# Altium project SmartHaloEE.PrjPcb (part 2 of 2)

## Sheet 7_LEDS.SchDoc: SmartHalo - Leds
size B; Author: Sébastien Gélinas; Organization: SmartHalo; Address1: 5445 de Gaspé; Address2: Montréal, QC; Address3: Canada; Address4: H2T 3B2; Revision: 1; SheetNumber: 7; SheetTotal: 7
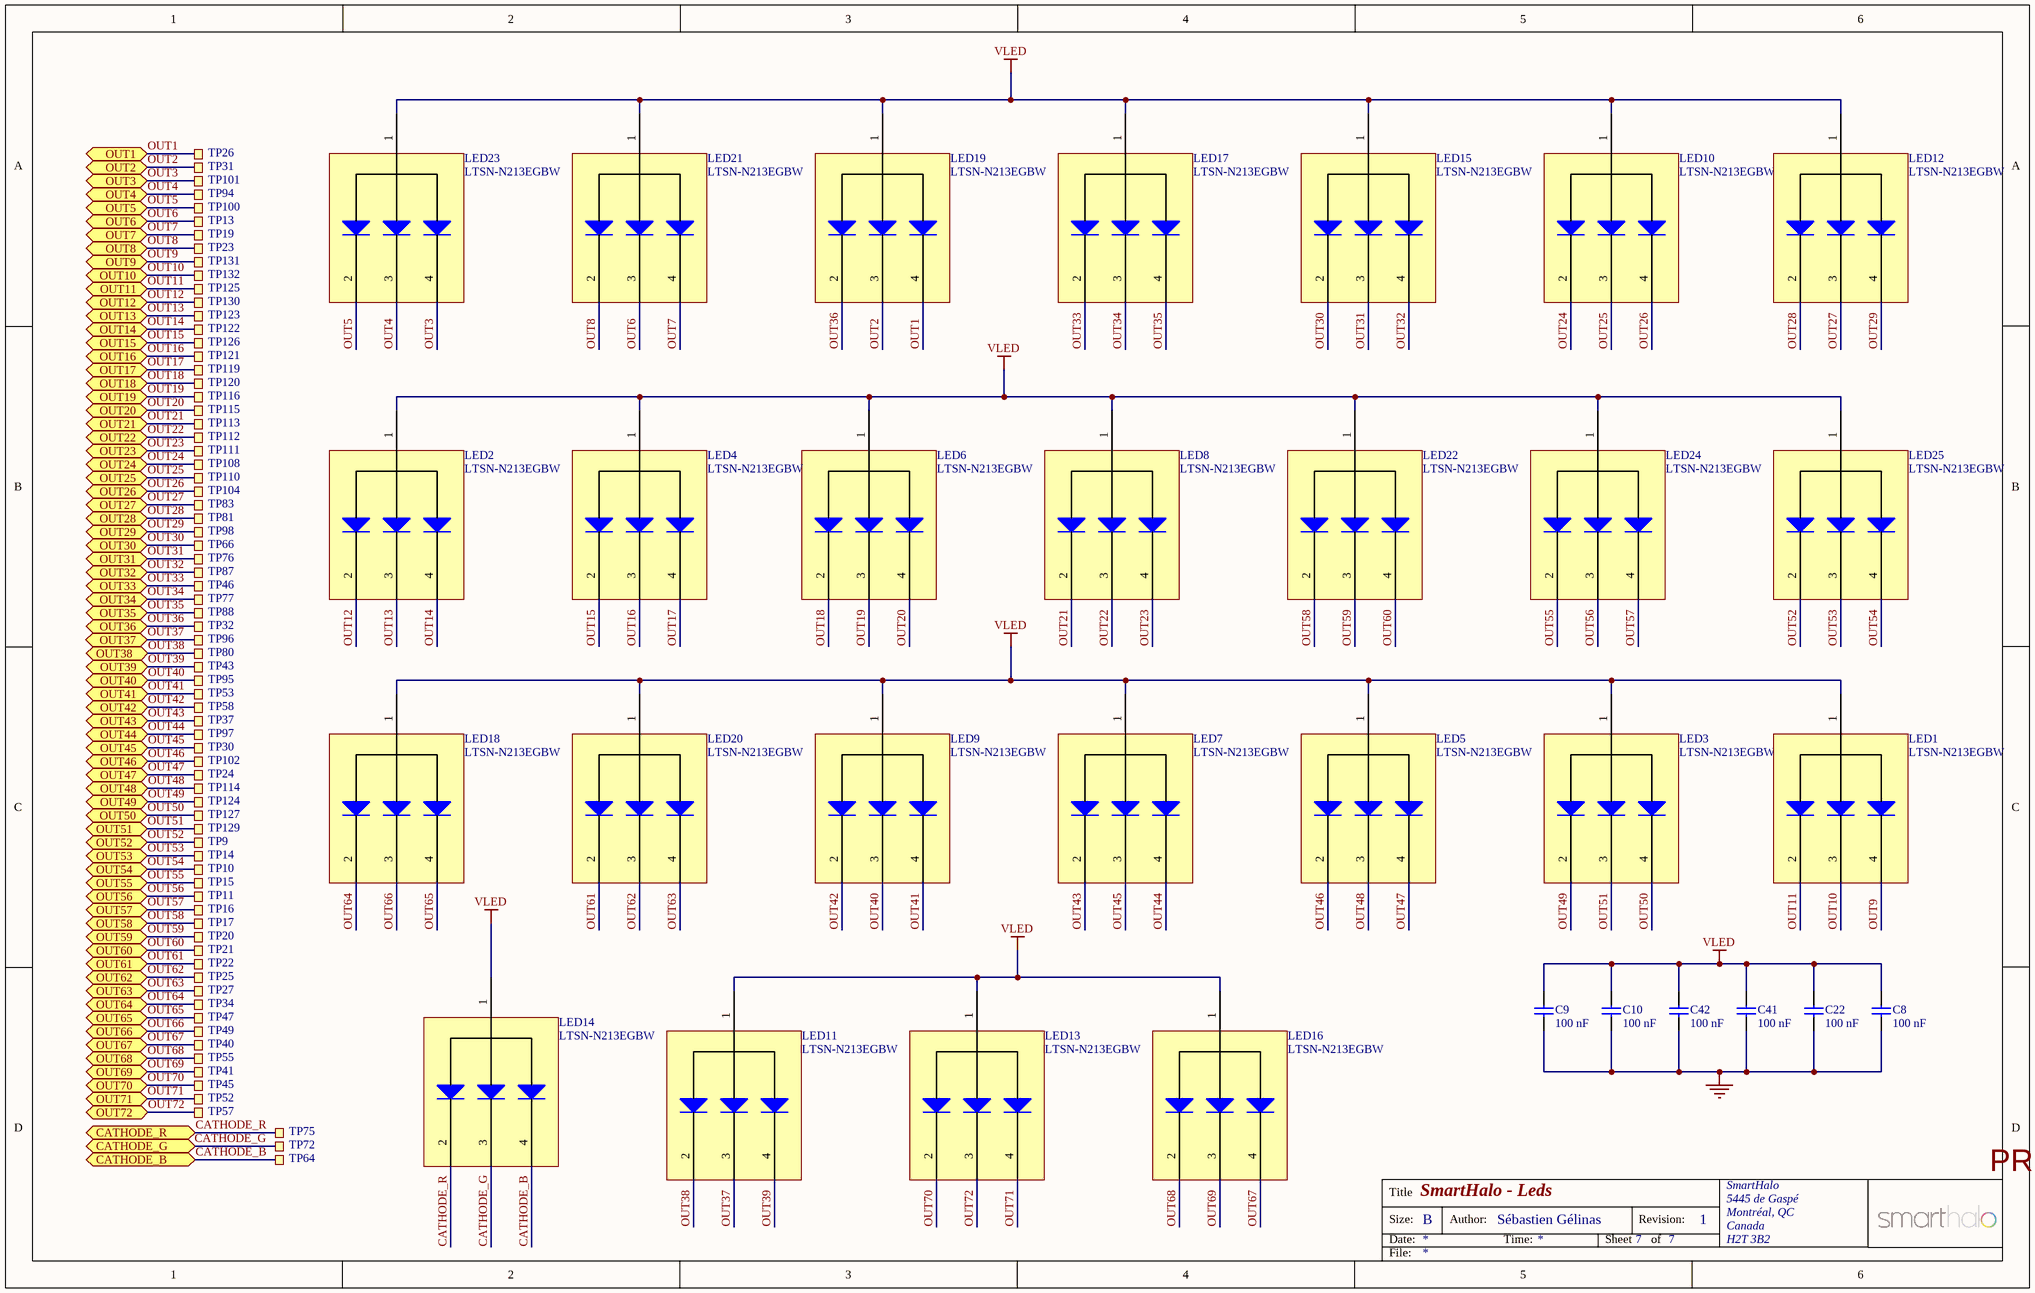
[diagram p7: 7_LEDS.SchDoc]

### Parts
C8  100 nF  [Varitron_CAP0402]
C9  100 nF  [Varitron_CAP0402]
C10  100 nF  [Varitron_CAP0402]
C22  100 nF  [Varitron_CAP0402]
C41  100 nF  [Varitron_CAP0402]
C42  100 nF  [Varitron_CAP0402]
LED1  LTSN-N213EGBW  [LTSN-N213EGBW]
LED2  LTSN-N213EGBW  [LTSN-N213EGBW]
LED3  LTSN-N213EGBW  [LTSN-N213EGBW]
LED4  LTSN-N213EGBW  [LTSN-N213EGBW]
LED5  LTSN-N213EGBW  [LTSN-N213EGBW]
LED6  LTSN-N213EGBW  [LTSN-N213EGBW]
LED7  LTSN-N213EGBW  [LTSN-N213EGBW]
LED8  LTSN-N213EGBW  [LTSN-N213EGBW]
LED9  LTSN-N213EGBW  [LTSN-N213EGBW]
LED10  LTSN-N213EGBW  [LTSN-N213EGBW]
LED11  LTSN-N213EGBW  [LTSN-N213EGBW]
LED12  LTSN-N213EGBW  [LTSN-N213EGBW]
LED13  LTSN-N213EGBW  [LTSN-N213EGBW]
LED14  LTSN-N213EGBW  [LTSN-N213EGBW]
LED15  LTSN-N213EGBW  [LTSN-N213EGBW]
LED16  LTSN-N213EGBW  [LTSN-N213EGBW]
LED17  LTSN-N213EGBW  [LTSN-N213EGBW]
LED18  LTSN-N213EGBW  [LTSN-N213EGBW]
LED19  LTSN-N213EGBW  [LTSN-N213EGBW]
LED20  LTSN-N213EGBW  [LTSN-N213EGBW]
LED21  LTSN-N213EGBW  [LTSN-N213EGBW]
LED22  LTSN-N213EGBW  [LTSN-N213EGBW]
LED23  LTSN-N213EGBW  [LTSN-N213EGBW]
LED24  LTSN-N213EGBW  [LTSN-N213EGBW]
LED25  LTSN-N213EGBW  [LTSN-N213EGBW]
TP9  (no value)  [TESTPAD-TH-35mils]  (no BOM)
TP10  (no value)  [TESTPAD-TH-35mils]  (no BOM)
TP11  (no value)  [TESTPAD-TH-35mils]  (no BOM)
TP13  (no value)  [TESTPAD-TH-35mils]  (no BOM)
TP14  (no value)  [TESTPAD-TH-35mils]  (no BOM)
TP15  (no value)  [TESTPAD-TH-35mils]  (no BOM)
TP16  (no value)  [TESTPAD-TH-35mils]  (no BOM)
TP17  (no value)  [TESTPAD-TH-35mils]  (no BOM)
TP19  (no value)  [TESTPAD-TH-35mils]  (no BOM)
TP20  (no value)  [TESTPAD-TH-35mils]  (no BOM)
TP21  (no value)  [TESTPAD-TH-35mils]  (no BOM)
TP22  (no value)  [TESTPAD-TH-35mils]  (no BOM)
TP23  (no value)  [TESTPAD-TH-35mils]  (no BOM)
TP24  (no value)  [TESTPAD-TH-35mils]  (no BOM)
TP25  (no value)  [TESTPAD-TH-35mils]  (no BOM)
TP26  (no value)  [TESTPAD-TH-35mils]  (no BOM)
TP27  (no value)  [TESTPAD-TH-35mils]  (no BOM)
TP30  (no value)  [TESTPAD-TH-35mils]  (no BOM)
TP31  (no value)  [TESTPAD-TH-35mils]  (no BOM)
TP32  (no value)  [TESTPAD-TH-35mils]  (no BOM)
TP34  (no value)  [TESTPAD-TH-35mils]  (no BOM)
TP37  (no value)  [TESTPAD-TH-35mils]  (no BOM)
TP40  (no value)  [TESTPAD-TH-35mils]  (no BOM)
TP41  (no value)  [TESTPAD-TH-35mils]  (no BOM)
TP43  (no value)  [TESTPAD-TH-35mils]  (no BOM)
TP45  (no value)  [TESTPAD-TH-35mils]  (no BOM)
TP46  (no value)  [TESTPAD-TH-35mils]  (no BOM)
TP47  (no value)  [TESTPAD-TH-35mils]  (no BOM)
TP49  (no value)  [TESTPAD-TH-35mils]  (no BOM)
TP52  (no value)  [TESTPAD-TH-35mils]  (no BOM)
TP53  (no value)  [TESTPAD-TH-35mils]  (no BOM)
TP55  (no value)  [TESTPAD-TH-35mils]  (no BOM)
TP57  (no value)  [TESTPAD-TH-35mils]  (no BOM)
TP58  (no value)  [TESTPAD-TH-35mils]  (no BOM)
TP64  (no value)  [TESTPAD-TH-35mils]  (no BOM)
TP66  (no value)  [TESTPAD-TH-35mils]  (no BOM)
TP72  (no value)  [TESTPAD-TH-35mils]  (no BOM)
TP75  (no value)  [TESTPAD-TH-35mils]  (no BOM)
TP76  (no value)  [TESTPAD-TH-35mils]  (no BOM)
TP77  (no value)  [TESTPAD-TH-35mils]  (no BOM)
TP80  (no value)  [TESTPAD-TH-35mils]  (no BOM)
TP81  (no value)  [TESTPAD-TH-35mils]  (no BOM)
TP83  (no value)  [TESTPAD-TH-35mils]  (no BOM)
TP87  (no value)  [TESTPAD-TH-35mils]  (no BOM)
TP88  (no value)  [TESTPAD-TH-35mils]  (no BOM)
TP94  (no value)  [TESTPAD-TH-35mils]  (no BOM)
TP95  (no value)  [TESTPAD-TH-35mils]  (no BOM)
TP96  (no value)  [TESTPAD-TH-35mils]  (no BOM)
TP97  (no value)  [TESTPAD-TH-35mils]  (no BOM)
TP98  (no value)  [TESTPAD-TH-35mils]  (no BOM)
TP100  (no value)  [TESTPAD-TH-35mils]  (no BOM)
TP101  (no value)  [TESTPAD-TH-35mils]  (no BOM)
TP102  (no value)  [TESTPAD-TH-35mils]  (no BOM)
TP104  (no value)  [TESTPAD-TH-35mils]  (no BOM)
TP108  (no value)  [TESTPAD-TH-35mils]  (no BOM)
TP110  (no value)  [TESTPAD-TH-35mils]  (no BOM)
TP111  (no value)  [TESTPAD-TH-35mils]  (no BOM)
TP112  (no value)  [TESTPAD-TH-35mils]  (no BOM)
TP113  (no value)  [TESTPAD-TH-35mils]  (no BOM)
TP114  (no value)  [TESTPAD-TH-35mils]  (no BOM)
TP115  (no value)  [TESTPAD-TH-35mils]  (no BOM)
TP116  (no value)  [TESTPAD-TH-35mils]  (no BOM)
TP119  (no value)  [TESTPAD-TH-35mils]  (no BOM)
TP120  (no value)  [TESTPAD-TH-35mils]  (no BOM)
TP121  (no value)  [TESTPAD-TH-35mils]  (no BOM)
TP122  (no value)  [TESTPAD-TH-35mils]  (no BOM)
TP123  (no value)  [TESTPAD-TH-35mils]  (no BOM)
TP124  (no value)  [TESTPAD-TH-35mils]  (no BOM)
TP125  (no value)  [TESTPAD-TH-35mils]  (no BOM)
TP126  (no value)  [TESTPAD-TH-35mils]  (no BOM)
TP127  (no value)  [TESTPAD-TH-35mils]  (no BOM)
TP129  (no value)  [TESTPAD-TH-35mils]  (no BOM)
TP130  (no value)  [TESTPAD-TH-35mils]  (no BOM)
TP131  (no value)  [TESTPAD-TH-35mils]  (no BOM)
TP132  (no value)  [TESTPAD-TH-35mils]  (no BOM)

### Ports
CATHODE_B, CATHODE_G, CATHODE_R, OUT1, OUT2, OUT3, OUT4, OUT5, OUT6, OUT7, OUT8, OUT9, OUT10, OUT11, OUT12, OUT13, OUT14, OUT15, OUT16, OUT17, OUT18, OUT19, OUT20, OUT21, OUT22, OUT23, OUT24, OUT25, OUT26, OUT27, OUT28, OUT29, OUT30, OUT31, OUT32, OUT33, OUT34, OUT35, OUT36, OUT37, OUT38, OUT39, OUT40, OUT41, OUT42, OUT43, OUT44, OUT45, OUT46, OUT47, OUT48, OUT49, OUT50, OUT51, OUT52, OUT53, OUT54, OUT55, OUT56, OUT57, OUT58, OUT59, OUT60, OUT61, OUT62, OUT63, OUT64, OUT65, OUT66, OUT67, OUT68, OUT69, OUT70, OUT71, OUT72

### Nets
GND: C8.2 C9.2 C10.2 C22.2 C41.2 C42.2
VLED: C8.1 C9.1 C10.1 C22.1 C41.1 C42.1 LED1.1(Anode) LED2.1(Anode) LED3.1(Anode) LED4.1(Anode) LED5.1(Anode) LED6.1(Anode) LED7.1(Anode) LED8.1(Anode) LED9.1(Anode) LED10.1(Anode) LED11.1(Anode) LED12.1(Anode) LED13.1(Anode) LED14.1(Anode) LED15.1(Anode) LED16.1(Anode) LED17.1(Anode) LED18.1(Anode) LED19.1(Anode) LED20.1(Anode) LED21.1(Anode) LED22.1(Anode) LED23.1(Anode) LED24.1(Anode) LED25.1(Anode)
CATHODE_B: LED14.4(Cathode_Blue) TP64.1 ; port CATHODE_B
CATHODE_G: TP72.1 ; port CATHODE_G
CATHODE_G: LED14.3(Cathode_Green)  [a separate net that carries the same name]
CATHODE_R: LED14.2(Cathode_Red) TP75.1 ; port CATHODE_R
OUT1: LED19.4(Cathode_Blue) TP26.1 ; port OUT1
OUT2: LED19.3(Cathode_Green) TP31.1 ; port OUT2
OUT3: LED23.4(Cathode_Blue) TP101.1 ; port OUT3
OUT4: LED23.3(Cathode_Green) TP94.1 ; port OUT4
OUT5: LED23.2(Cathode_Red) TP100.1 ; port OUT5
OUT6: LED21.3(Cathode_Green) TP13.1 ; port OUT6
OUT7: LED21.4(Cathode_Blue) TP19.1 ; port OUT7
OUT8: LED21.2(Cathode_Red) TP23.1 ; port OUT8
OUT9: LED1.4(Cathode_Blue) TP131.1 ; port OUT9
OUT10: LED1.3(Cathode_Green) TP132.1 ; port OUT10
OUT11: LED1.2(Cathode_Red) TP125.1 ; port OUT11
OUT12: LED2.2(Cathode_Red) TP130.1 ; port OUT12
OUT13: LED2.3(Cathode_Green) TP123.1 ; port OUT13
OUT14: LED2.4(Cathode_Blue) TP122.1 ; port OUT14
OUT15: LED4.2(Cathode_Red) TP126.1 ; port OUT15
OUT16: LED4.3(Cathode_Green) TP121.1 ; port OUT16
OUT17: LED4.4(Cathode_Blue) TP119.1 ; port OUT17
OUT18: LED6.2(Cathode_Red) TP120.1 ; port OUT18
OUT19: LED6.3(Cathode_Green) TP116.1 ; port OUT19
OUT20: LED6.4(Cathode_Blue) TP115.1 ; port OUT20
OUT21: LED8.2(Cathode_Red) TP113.1 ; port OUT21
OUT22: LED8.3(Cathode_Green) TP112.1 ; port OUT22
OUT23: LED8.4(Cathode_Blue) TP111.1 ; port OUT23
OUT24: LED10.2(Cathode_Red) TP108.1 ; port OUT24
OUT25: LED10.3(Cathode_Green) TP110.1 ; port OUT25
OUT26: LED10.4(Cathode_Blue) TP104.1 ; port OUT26
OUT27: LED12.3(Cathode_Green) TP83.1 ; port OUT27
OUT28: LED12.2(Cathode_Red) TP81.1 ; port OUT28
OUT29: LED12.4(Cathode_Blue) TP98.1 ; port OUT29
OUT30: LED15.2(Cathode_Red) TP66.1 ; port OUT30
OUT31: LED15.3(Cathode_Green) TP76.1 ; port OUT31
OUT32: LED15.4(Cathode_Blue) TP87.1 ; port OUT32
OUT33: LED17.2(Cathode_Red) TP46.1 ; port OUT33
OUT34: LED17.3(Cathode_Green) TP77.1 ; port OUT34
OUT35: LED17.4(Cathode_Blue) TP88.1 ; port OUT35
OUT36: LED19.2(Cathode_Red) TP32.1 ; port OUT36
OUT37: LED11.3(Cathode_Green) TP96.1 ; port OUT37
OUT38: LED11.2(Cathode_Red) TP80.1 ; port OUT38
OUT39: LED11.4(Cathode_Blue) TP43.1 ; port OUT39
OUT40: LED9.3(Cathode_Green) TP95.1 ; port OUT40
OUT41: LED9.4(Cathode_Blue) TP53.1 ; port OUT41
OUT42: LED9.2(Cathode_Red) TP58.1 ; port OUT42
OUT43: LED7.2(Cathode_Red) TP37.1 ; port OUT43
OUT44: LED7.4(Cathode_Blue) TP97.1 ; port OUT44
OUT45: LED7.3(Cathode_Green) TP30.1 ; port OUT45
OUT46: LED5.2(Cathode_Red) TP102.1 ; port OUT46
OUT47: LED5.4(Cathode_Blue) TP24.1 ; port OUT47
OUT48: LED5.3(Cathode_Green) TP114.1 ; port OUT48
OUT49: LED3.2(Cathode_Red) TP124.1 ; port OUT49
OUT50: LED3.4(Cathode_Blue) TP127.1 ; port OUT50
OUT51: LED3.3(Cathode_Green) TP129.1 ; port OUT51
OUT52: LED25.2(Cathode_Red) TP9.1 ; port OUT52
OUT53: LED25.3(Cathode_Green) TP14.1 ; port OUT53
OUT54: LED25.4(Cathode_Blue) TP10.1 ; port OUT54
OUT55: LED24.2(Cathode_Red) TP15.1 ; port OUT55
OUT56: LED24.3(Cathode_Green) TP11.1 ; port OUT56
OUT57: LED24.4(Cathode_Blue) TP16.1 ; port OUT57
OUT58: LED22.2(Cathode_Red) TP17.1 ; port OUT58
OUT59: LED22.3(Cathode_Green) TP20.1 ; port OUT59
OUT60: LED22.4(Cathode_Blue) TP21.1 ; port OUT60
OUT61: LED20.2(Cathode_Red) TP22.1 ; port OUT61
OUT62: LED20.3(Cathode_Green) TP25.1 ; port OUT62
OUT63: LED20.4(Cathode_Blue) TP27.1 ; port OUT63
OUT64: LED18.2(Cathode_Red) TP34.1 ; port OUT64
OUT65: LED18.4(Cathode_Blue) TP47.1 ; port OUT65
OUT66: LED18.3(Cathode_Green) TP49.1 ; port OUT66
OUT67: LED16.4(Cathode_Blue) TP40.1 ; port OUT67
OUT68: LED16.2(Cathode_Red) TP55.1 ; port OUT68
OUT69: LED16.3(Cathode_Green) TP41.1 ; port OUT69
OUT70: LED13.2(Cathode_Red) TP45.1 ; port OUT70
OUT71: LED13.4(Cathode_Blue) TP52.1 ; port OUT71
OUT72: LED13.3(Cathode_Green) TP57.1 ; port OUT72

### Notes on the sheet
- PRELIMINARY: DO NOT USE FOR PRODUCTION
- Labels drawn without touching a wire or pin: CATHODE_G
- Title
- Size:
- Date:
- B
- Author:
- Time:
- Sheet
- Revision:
- of
- File:

### Library data of the parts
C8-C10 C22 C41 C42 = Varitron_CAP0402: 100 nF 10V X7R 10% 0402 (1005 Metric)  SMD; Case-EIA: 0402; Case-Metric: 1005; Tolerance: 10%; Technology: SMT; Temperature Coefficient: X7R; Voltage Rating: 10V; Value: 100 nF
LED1-LED25 = LTSN-N213EGBW: LED SMD LTSN-N213EGBW; Manufacturer: LiteOn; Manufacturer Part Number: LTSN-N213EGBW; Part Number: LTSN-N213EGBW
TP9-TP11 TP13-TP17 TP19-TP27 TP30-TP32 TP34 TP37 TP40 TP41 TP43 TP45-TP47 TP49 TP52 TP53 TP55 TP57 TP58 TP64 TP66 TP72 TP75-TP77 TP80 TP81 TP83 TP87 TP88 TP94-TP98 TP100-TP102 TP104 TP108 TP110-TP116 TP119-TP127 TP129-TP132 = TESTPAD_TH_35mils: Testpoint, through hole, 35 mils; Value: TP

## Nets that join several sheets
GND: 1_PWR (32 pins), 2_BLE (30 pins), 3_LEDDRIVERS (20 pins), 4_SENSORS (11 pins), 5_MISC (19 pins), 6_ALARM (13 pins), 7_LEDS (6 pins)
S2V8: 1_PWR (C47.1 TP128.1 U12.5), 4_SENSORS (C2.1 C3.1 U1.5), 6_ALARM (6 pins)
VBZ: 1_PWR (C30.1 D3.1 R15.2 TP54.1), 6_ALARM (Q3.2 Q4.2 R22.2 R25.2)
VDD_nRF: 1_PWR (C49.1 TP18.1 U13.5), 2_BLE (14 pins), 4_SENSORS (8 pins), 5_MISC (C59.1 C60.1 U16.1)
VLED: 1_PWR (C53.1 U15.2 U15.10), 3_LEDDRIVERS (9 pins), 7_LEDS (31 pins)
VUSB: 1_PWR (C23.1 TP90.1 U5.1), 5_MISC (6 pins)
ALARMB: 1_PWR (TP8.1 U14.4), 2_BLE (R30.1 U3.14)
BZR: 2_BLE (U3.4), 6_ALARM (5 pins)
~{CHG}: 1_PWR (U5.8), 2_BLE (R13.2 U3.18)
CATHODE_B: 3_LEDDRIVERS (R14.2), 7_LEDS (LED14.4 TP64.1)
CATHODE_G: 3_LEDDRIVERS (R11.2), 7_LEDS (TP72.1)
CATHODE_R: 3_LEDDRIVERS (R7.2), 7_LEDS (LED14.2 TP75.1)
CENTRAL_B: 2_BLE (U3.41), 3_LEDDRIVERS (Q2.2 TP68.1)
CENTRAL_G: 2_BLE (U3.42), 3_LEDDRIVERS (Q2.5 TP67.1)
CENTRAL_R: 2_BLE (U3.40), 3_LEDDRIVERS (Q1.5 TP78.1)
CTS: 2_BLE (U3.28), 5_MISC (TP103.1 U16.8)
EN_2_8V: 1_PWR (TP12.1 U12.3), 2_BLE (R29.2 U3.16)
EN_POW_MCU: 1_PWR (U13.3), 2_BLE (Q1.6 R4.1 TP6.1)
EN_VLED: 1_PWR (TP69.1 U15.6), 2_BLE (R31.2 U3.15)
FRONTLED: 2_BLE (U3.43), 3_LEDDRIVERS (TP105.1 U4.1 U6.1)
INT_1_XL: 2_BLE (U3.5), 4_SENSORS (TP5.1 U11.12)
INT_2_XL: 2_BLE (U3.6), 4_SENSORS (TP4.1 U11.11)
INT_MAG: 2_BLE (U3.7), 4_SENSORS (TP2.1 U11.7)
ISET2: 1_PWR (TP74.1 U5.7), 2_BLE (U3.19)
OUT1: 3_LEDDRIVERS (U2.43), 7_LEDS (LED19.4 TP26.1)
OUT2: 3_LEDDRIVERS (U2.44), 7_LEDS (LED19.3 TP31.1)
OUT3: 3_LEDDRIVERS (U2.1), 7_LEDS (LED23.4 TP101.1)
OUT4: 3_LEDDRIVERS (U2.2), 7_LEDS (LED23.3 TP94.1)
OUT5: 3_LEDDRIVERS (U2.3), 7_LEDS (LED23.2 TP100.1)
OUT6: 3_LEDDRIVERS (U2.4), 7_LEDS (LED21.3 TP13.1)
OUT7: 3_LEDDRIVERS (U2.5), 7_LEDS (LED21.4 TP19.1)
OUT8: 3_LEDDRIVERS (U2.6), 7_LEDS (LED21.2 TP23.1)
OUT9: 3_LEDDRIVERS (U2.7), 7_LEDS (LED1.4 TP131.1)
OUT10: 3_LEDDRIVERS (U2.8), 7_LEDS (LED1.3 TP132.1)
OUT11: 3_LEDDRIVERS (U2.9), 7_LEDS (LED1.2 TP125.1)
OUT12: 3_LEDDRIVERS (U2.10), 7_LEDS (LED2.2 TP130.1)
OUT13: 3_LEDDRIVERS (U2.11), 7_LEDS (LED2.3 TP123.1)
OUT14: 3_LEDDRIVERS (U2.12), 7_LEDS (LED2.4 TP122.1)
OUT15: 3_LEDDRIVERS (U2.13), 7_LEDS (LED4.2 TP126.1)
OUT16: 3_LEDDRIVERS (U2.14), 7_LEDS (LED4.3 TP121.1)
OUT17: 3_LEDDRIVERS (U2.15), 7_LEDS (LED4.4 TP119.1)
OUT18: 3_LEDDRIVERS (U2.16), 7_LEDS (LED6.2 TP120.1)
OUT19: 3_LEDDRIVERS (U2.18), 7_LEDS (LED6.3 TP116.1)
OUT20: 3_LEDDRIVERS (U2.19), 7_LEDS (LED6.4 TP115.1)
OUT21: 3_LEDDRIVERS (U2.20), 7_LEDS (LED8.2 TP113.1)
OUT22: 3_LEDDRIVERS (U2.21), 7_LEDS (LED8.3 TP112.1)
OUT23: 3_LEDDRIVERS (U2.22), 7_LEDS (LED8.4 TP111.1)
OUT24: 3_LEDDRIVERS (U2.23), 7_LEDS (LED10.2 TP108.1)
OUT25: 3_LEDDRIVERS (U2.24), 7_LEDS (LED10.3 TP110.1)
OUT26: 3_LEDDRIVERS (U2.25), 7_LEDS (LED10.4 TP104.1)
OUT27: 3_LEDDRIVERS (U2.26), 7_LEDS (LED12.3 TP83.1)
OUT28: 3_LEDDRIVERS (U2.27), 7_LEDS (LED12.2 TP81.1)
OUT29: 3_LEDDRIVERS (U2.28), 7_LEDS (LED12.4 TP98.1)
OUT30: 3_LEDDRIVERS (U2.29), 7_LEDS (LED15.2 TP66.1)
OUT31: 3_LEDDRIVERS (U2.30), 7_LEDS (LED15.3 TP76.1)
OUT32: 3_LEDDRIVERS (U2.31), 7_LEDS (LED15.4 TP87.1)
OUT33: 3_LEDDRIVERS (U2.32), 7_LEDS (LED17.2 TP46.1)
OUT34: 3_LEDDRIVERS (U2.33), 7_LEDS (LED17.3 TP77.1)
OUT35: 3_LEDDRIVERS (U2.34), 7_LEDS (LED17.4 TP88.1)
OUT36: 3_LEDDRIVERS (U2.35), 7_LEDS (LED19.2 TP32.1)
OUT37: 3_LEDDRIVERS (U10.43), 7_LEDS (LED11.3 TP96.1)
OUT38: 3_LEDDRIVERS (U10.44), 7_LEDS (LED11.2 TP80.1)
OUT39: 3_LEDDRIVERS (U10.1), 7_LEDS (LED11.4 TP43.1)
OUT40: 3_LEDDRIVERS (U10.2), 7_LEDS (LED9.3 TP95.1)
OUT41: 3_LEDDRIVERS (U10.3), 7_LEDS (LED9.4 TP53.1)
OUT42: 3_LEDDRIVERS (U10.4), 7_LEDS (LED9.2 TP58.1)
OUT43: 3_LEDDRIVERS (U10.5), 7_LEDS (LED7.2 TP37.1)
OUT44: 3_LEDDRIVERS (U10.6), 7_LEDS (LED7.4 TP97.1)
OUT45: 3_LEDDRIVERS (U10.7), 7_LEDS (LED7.3 TP30.1)
OUT46: 3_LEDDRIVERS (U10.8), 7_LEDS (LED5.2 TP102.1)
OUT47: 3_LEDDRIVERS (U10.9), 7_LEDS (LED5.4 TP24.1)
OUT48: 3_LEDDRIVERS (U10.10), 7_LEDS (LED5.3 TP114.1)
OUT49: 3_LEDDRIVERS (U10.11), 7_LEDS (LED3.2 TP124.1)
OUT50: 3_LEDDRIVERS (U10.12), 7_LEDS (LED3.4 TP127.1)
OUT51: 3_LEDDRIVERS (U10.13), 7_LEDS (LED3.3 TP129.1)
OUT52: 3_LEDDRIVERS (U10.14), 7_LEDS (LED25.2 TP9.1)
OUT53: 3_LEDDRIVERS (U10.15), 7_LEDS (LED25.3 TP14.1)
OUT54: 3_LEDDRIVERS (U10.16), 7_LEDS (LED25.4 TP10.1)
OUT55: 3_LEDDRIVERS (U10.18), 7_LEDS (LED24.2 TP15.1)
OUT56: 3_LEDDRIVERS (U10.19), 7_LEDS (LED24.3 TP11.1)
OUT57: 3_LEDDRIVERS (U10.20), 7_LEDS (LED24.4 TP16.1)
OUT58: 3_LEDDRIVERS (U10.21), 7_LEDS (LED22.2 TP17.1)
OUT59: 3_LEDDRIVERS (U10.22), 7_LEDS (LED22.3 TP20.1)
OUT60: 3_LEDDRIVERS (U10.23), 7_LEDS (LED22.4 TP21.1)
OUT61: 3_LEDDRIVERS (U10.24), 7_LEDS (LED20.2 TP22.1)
OUT62: 3_LEDDRIVERS (U10.25), 7_LEDS (LED20.3 TP25.1)
OUT63: 3_LEDDRIVERS (U10.26), 7_LEDS (LED20.4 TP27.1)
OUT64: 3_LEDDRIVERS (U10.27), 7_LEDS (LED18.2 TP34.1)
OUT65: 3_LEDDRIVERS (U10.28), 7_LEDS (LED18.4 TP47.1)
OUT66: 3_LEDDRIVERS (U10.29), 7_LEDS (LED18.3 TP49.1)
OUT67: 3_LEDDRIVERS (U10.30), 7_LEDS (LED16.4 TP40.1)
OUT68: 3_LEDDRIVERS (U10.31), 7_LEDS (LED16.2 TP55.1)
OUT69: 3_LEDDRIVERS (U10.32), 7_LEDS (LED16.3 TP41.1)
OUT70: 3_LEDDRIVERS (U10.33), 7_LEDS (LED13.2 TP45.1)
OUT71: 3_LEDDRIVERS (U10.34), 7_LEDS (LED13.4 TP52.1)
OUT72: 3_LEDDRIVERS (U10.35), 7_LEDS (LED13.3 TP57.1)
~{PG}: 1_PWR (U5.5), 2_BLE (R10.1 U3.20)
QTOUCH: 2_BLE (R6.1 U3.38), 4_SENSORS (TP118.1 U1.1)
RTS: 2_BLE (U3.22), 5_MISC (TP86.1 U16.32)
RXD: 2_BLE (U3.21), 5_MISC (TP82.1 U16.30)
~{SLEEP}: 2_BLE (U3.29), 5_MISC (TP91.1 U16.9)
SCL: 1_PWR (U14.8), 2_BLE (R20.1 TP7.1 U3.9), 3_LEDDRIVERS (U2.42 U10.42), 4_SENSORS (U11.1)
SDA: 1_PWR (U14.7), 2_BLE (R16.1 TP33.1 U3.10), 3_LEDDRIVERS (U2.41 U10.41), 4_SENSORS (U11.4)
SDB: 2_BLE (R17.2 TP62.1 U3.8), 3_LEDDRIVERS (U2.36 U10.36)
SYNC/MODE: 2_BLE (U3.37), 4_SENSORS (TP117.1 U1.6)
TXD: 2_BLE (U3.23), 5_MISC (TP89.1 U16.2)
VBZ_EN: 1_PWR (TP29.1 U7.5), 2_BLE (R28.1 U3.17)
~{WAKEUP}: 2_BLE (U3.27), 5_MISC (TP106.1 U16.3)